# Altium schematic sheet LM2596_Power_Supply_Adjustable.SchDoc
size A4
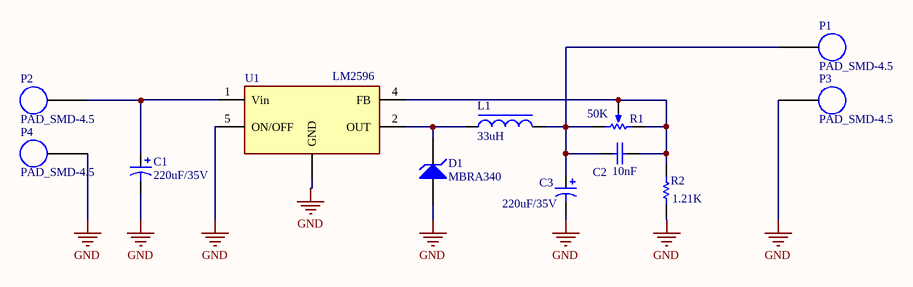
[diagram p0: LM2596_Power_Supply_Adjustable.SchDoc]

## Parts
C1  220uF/35V  [Cap_Al_SMD_C6_6.6x6.6mm]
C2  10nF  [C2012[0805]]
C3  220uF/35V  [Cap_Al_SMD_C6_6.6x6.6mm]
D1  MBRA340  [DO214AC]
L1  33uH  [Inductor-744770133]
P1  PAD_SMD-4.5  [PAD_SMD_4.5]
P2  PAD_SMD-4.5  [PAD_SMD_4.5]
P3  PAD_SMD-4.5  [PAD_SMD_4.5]
P4  PAD_SMD-4.5  [PAD_SMD_4.5]
R1  50K  [VR1]
R2  1.21K  [R2012[0805]]
U1  LM2596  [3961-02]

## Nets
GND: C1.2 C3.2 D1.1(A) P3.1 P4.1 R2.1 U1.3(GND) U1.5(ON/OFF)
NetC1_1: C1.1 P2.1 U1.1(Vin)
NetC2_1: C2.1 C3.1 L1.2 P1.1 R1.2(BOT)
NetC2_2: C2.2 R1.1(TOP) R1.3(TAP) R2.2 U1.4(FB)
NetD1_2: D1.2(K) L1.1 U1.2(OUT)

## Library data of the parts
C1 C3 = CP: Polarized Capacitor; Manufacturer: *; PartNumber: *; Package Type: *; Value: *
C2 = C: Capacitor; Value: 1; Manufacturer: *; PartNumber: *; Package Type: *
D1 = D Zener: Zener Diode; Manufacturer: *; PartNumber: *; Package Type: *
L1 = L: Inductor; Manufacturer: *; PartNumber: *; Package Type: *; Value: *
R1 = RPot: Potentiometer; Sim Note: Enter the Resistance value and the set point into parameter fields.; Set Position: 0.5; 50K: 1K; Published: 8-Jun-2000; LatestRevisionDate: 17-Jul-2002; LatestRevisionNote: Re-released for DXP Platform.; PackageReference: VR5; Publisher: Altium Limited; PackageDescription: Variable Resistor, Thru-Hole; 3 Leads
R2 = R: Resistor; Value: 0; Manufacturer: *; PartNumber: *; Package Type: *